# Altium schematic sheet GPS.SchDoc
size OrCAD A
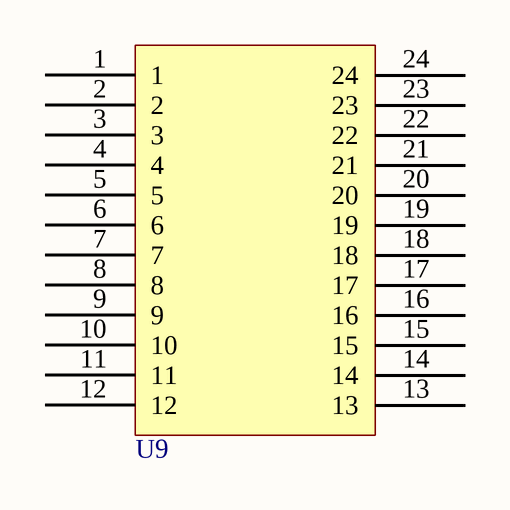
[diagram p0: GPS.SchDoc]

## Parts
U9  NEO-M8P-2  [NEO-M8P-2]  (value not drawn)

## Nets

Not connected (* = marked no-connect by the designer): U9 1 2 3 4 5 6 7 8 9 10 11 12 13 14 15 16 17 18 19 20 21 22 23 24

## Notes on the sheet
- Title
- Size:
- Date:
- Orcad A
- Number:
- Time:
- Revision:
- Sheet
- of
- ZLS Corporation
- 7801 North Lamar Blvd.
- Suite E-184
- Austin, Texas 78752  USA
- (512) 453-0288
- File: